# EAGLE design ERpcuk (EAGLE 7.7.0)

## Sheet 1 of 2
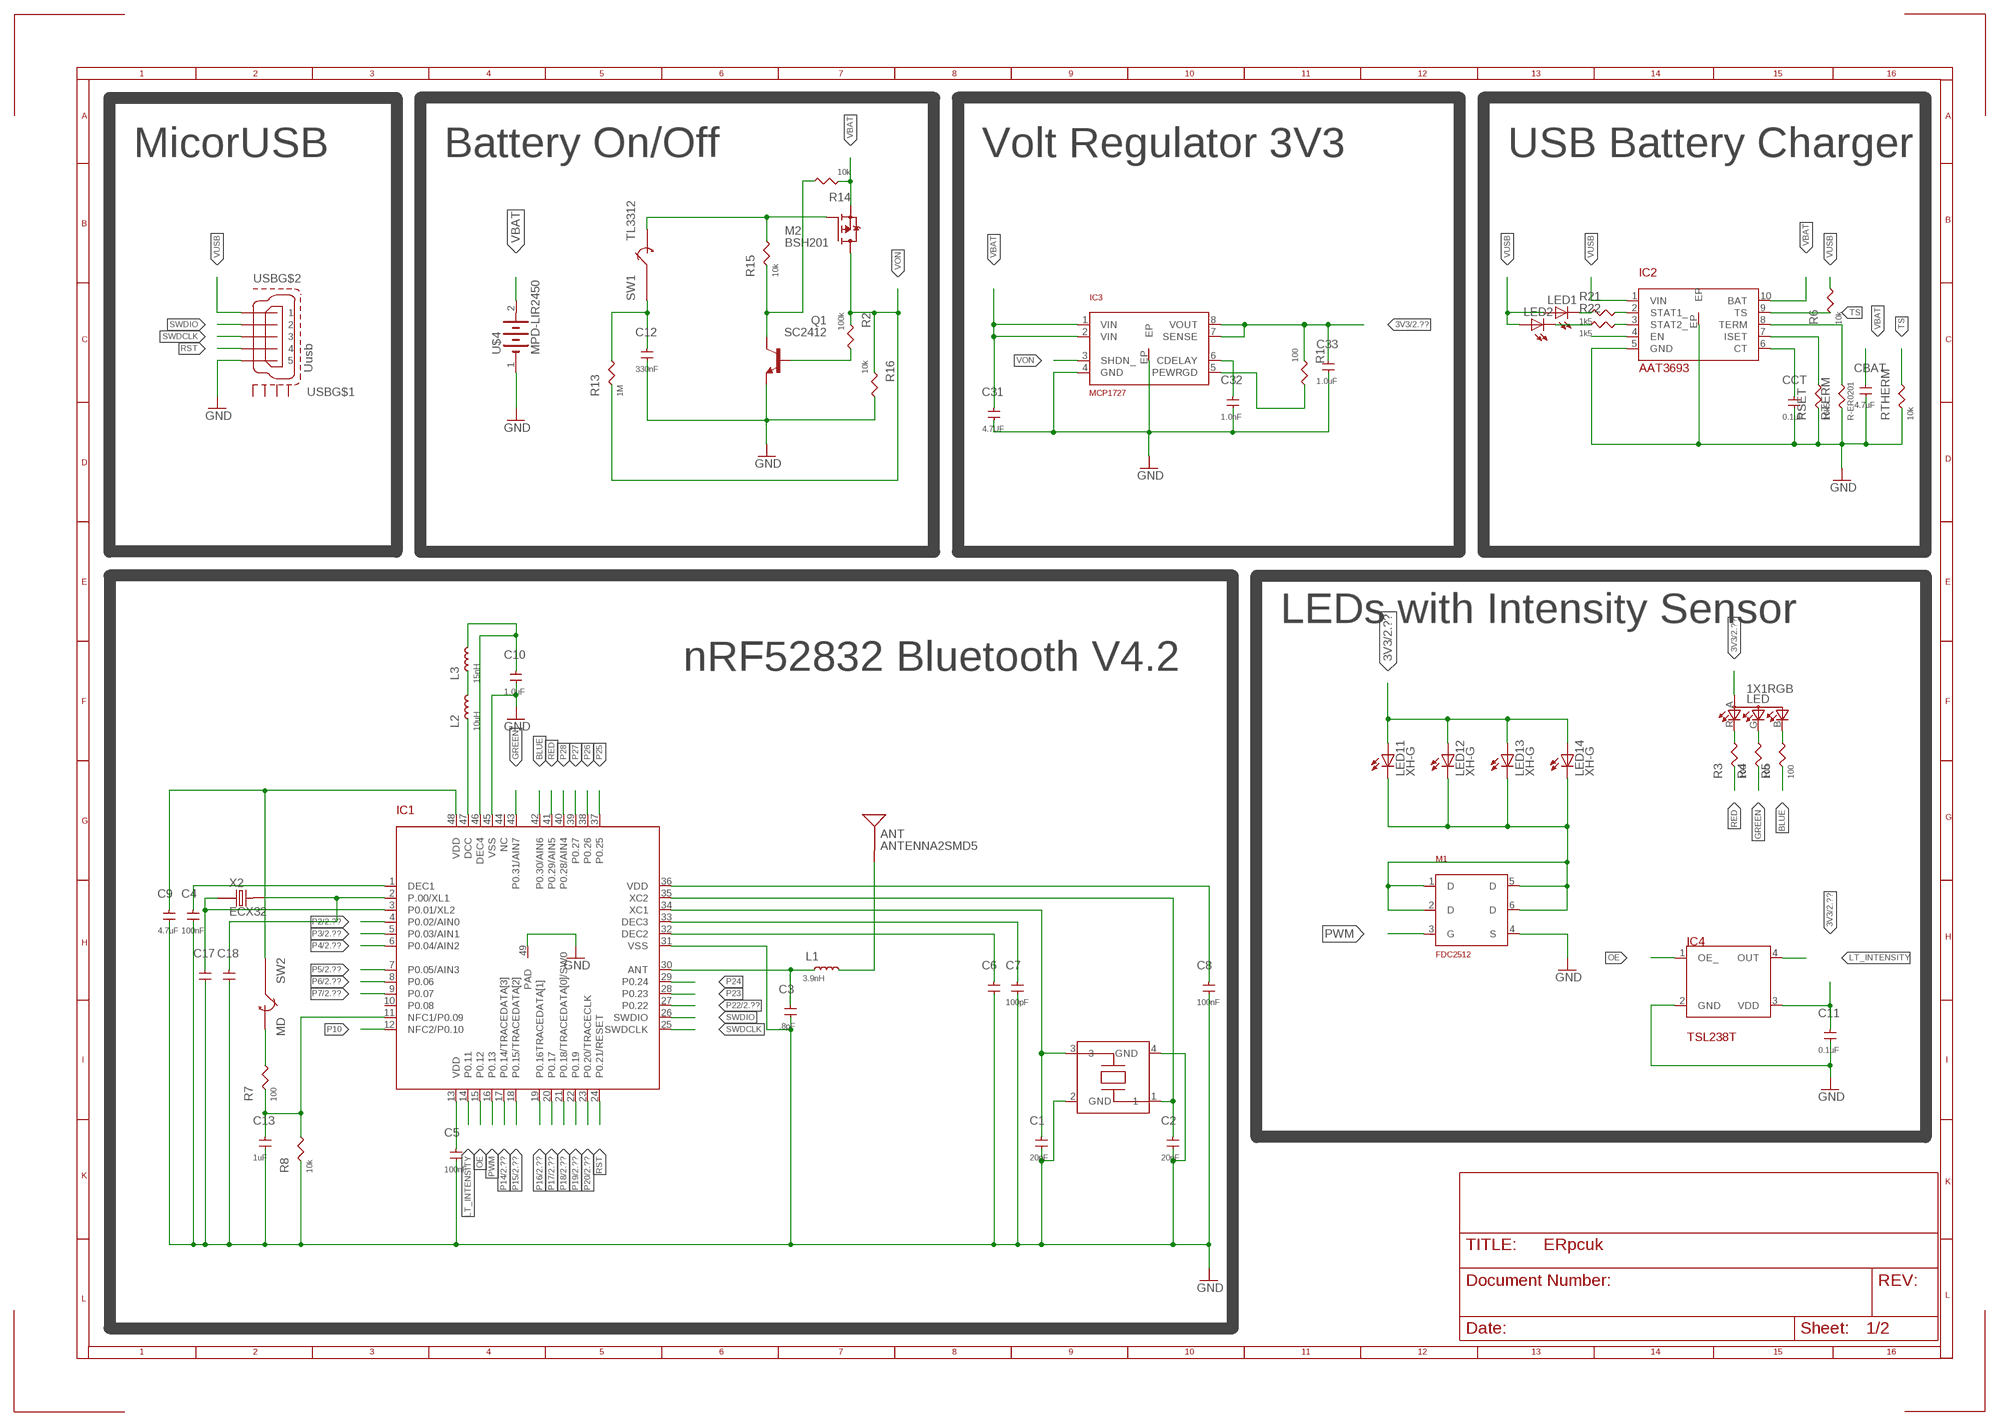
[diagram p0: schematic, sheet 1]

### Parts
ANT  ANTENNA2SMD5  [ANTENNA-CHIP5]
C1  20pF  C-ER201  [C0201]
C2  20pF  C-ER201  [C0201]
C3  .8pF  C-ER201  [C0201]
C4  100nF  C-ER201  [C0201]
C5  100nF  C-ER201  [C0201]
C6  C-ER201  [C0201]
C7  100pF  C-ER201  [C0201]
C8  100nF  C-ER201  [C0201]
C9  4.7uF  C-ERC0402  [C0402]
C10  1.0uF  C-ER201  [C0201]
C11  0.1uF  C-ER201  [C0201]
C12  330nF  C-ER201  [C0201]
C13  1uF  C-ER201  [C0201]
C17  C-ER201  [C0201]
C18  C-ER201  [C0201]
C31  4.7UF  C-ERC0402  [C0402]
C32  1.0nF  C-ER201  [C0201]
C33  1.0uF  C-ER201  [C0201]
CBAT  4.7uF  C-ERC0402  [C0402]
CCT  0.1uF  C-ER201  [C0201]
IC1  NRF52832  [QFN48]
IC2  AAT3693  [AAT3693]
IC3  MCP1727  [DFN8-3X3]
IC4  TSL238T  [T4]
L1  3.9nH  L-ER0201  [C0201]
L2  10uH  L-ERL603  [R0603]
L3  15nH  L-ER0201  [C0201]
LED  1X1RGB  [1X1]
LED1  LEDCHIP-LED0603  [CHIP-LED0603]
LED2  LEDCHIP-LED0603  [CHIP-LED0603]
LED11  XH-G  [XH-G]
LED12  XH-G  [XH-G]
LED13  XH-G  [XH-G]
LED14  XH-G  [XH-G]
M1  FDC2512  [SSOT6]
M2  BSH201  [SOT23]
Q1  SC2412  [SC59-BEC]
R1  100  R-ER0201  [R0201]
R2  100k  R-ER0201  [R0201]
R3  100  R-ER0201  [R0201]
R4  100  R-ER0201  [R0201]
R5  100  R-ER0201  [R0201]
R6  10k  R-ER0201  [R0201]
R7  100  R-ER0201  [R0201]
R8  10k  R-ER0201  [R0201]
R13  1M  R-ER0201  [R0201]
R14  10k  R-ER0201  [R0201]
R15  10k  R-ER0201  [R0201]
R16  10k  R-ER0201  [R0201]
R21  1k5  R-ER0201  [R0201]
R22  1k5  R-ER0201  [R0201]
RSET  16k5  R-ER0201  [R0201]
RTERM  R-ER0201  [R0201]
RTHERM  10k  R-ER0201  [R0201]
SW1  TL3312  [TL3312]
SW2  MD  [MD]
U$4  MPD-LIR2450  [LIR2450]
USB  Uusb  MICRO-USB-SHIELD-ZX62R-B-5P  [ZX62R-B-5P]
X1  FA-128  [FA-128]
X2  ECX32  [ECX39]

### Nets
3V3: C5.2 C8.2 C9.2 C11.2 C33.2 IC1.13(VDD) IC1.36(VDD) IC1.48(VDD) IC3.7(SENSE) IC3.8(VOUT) IC4.3(VDD) LED11.2(A) LED12.2(A) LED13.2(A) LED14.2(A) LED.A(A2) R1.1 SW2.P$1 ; also sheet 2
BLUE: IC1.42(P0.30/AIN6) R5.1
GND: C1.1 C2.1 C3.1 C4.1 C5.1 C6.1 C7.1 C8.1 C9.1 C10.1 C11.1 C12.1 C13.1 C17.1 C18.1 C31.1 C32.1 C33.1 CBAT.1 CCT.1 IC1.31(VSS) IC1.45(VSS) IC1.49(PAD) IC2.5(GND) IC2.EP IC3.4(GND) IC3.EP IC4.2(GND) M1.4(S) Q1.E R8.1 R16.2 RSET.1 RTERM.1 RTHERM.1 U$4.1(-) USB.1 X1.2(GND) X1.4(GND) ; also sheet 2
GREEN: IC1.43(P0.31/AIN7) R4.1
LT_INTENSITY: IC1.14(P0.11) IC4.4(OUT)
N$2: LED11.1(C) LED12.1(C) LED13.1(C) LED14.1(C) M1.1(D) M1.2(D) M1.5(D) M1.6(D)
N$3: Q1.B R2.2
N$4: C3.2 IC1.30(ANT) L1.1
N$5: C6.2 IC1.32(DEC2)
N$6: ANT.FEED(SIGNAL) L1.2
N$7: C7.2 IC1.33(DEC3)
N$8: C1.2 IC1.34(XC1) X1.3
N$9: C2.2 IC1.35(XC2) X1.1
N$10: Q1.C R14.2 R15.1
N$11: IC1.47(DCC) L2.1
N$12: L2.2 L3.1
N$13: C10.2 IC1.46(DEC4) L3.2
N$15: C12.2 R13.2 SW1.1
N$16: LED.B(CGREEN) R5.2
N$17: CCT.2 IC2.6(CT)
N$18: IC2.7(ISET) RSET.2
N$19: IC2.8(TERM) RTERM.2
N$20: IC2.3(STAT2_) R22.2
N$21: IC2.2(STAT1_) R21.2
N$22: LED1.C R21.1
N$23: LED2.C R22.1
N$24: LED.G(CBLUE) R4.2
N$25: IC3.5(PEWRGD) R1.2
N$26: LED.R(CRED) R3.2
N$27: C32.2 IC3.6(CDELAY)
N$28: M2.1(G) R15.2 SW1.3
N$31: C18.2 IC1.2(P.00/XL1) X2.P$2
N$32: C17.2 IC1.3(P0.01/XL2) X2.P$1
N$34: R7.2 SW2.P$2
N$35: C13.2 IC1.11(NFC1/P0.09) R7.1 R8.2
N$36: C4.2 IC1.1(DEC1)
OE: IC1.15(P0.12) IC4.1(OE_)
P2: IC1.4(P0.02/AIN0) ; also sheet 2
P3: IC1.5(P0.03/AIN1) ; also sheet 2
P4: IC1.6(P0.04/AIN2) ; also sheet 2
P5: IC1.7(P0.05/AIN3) ; also sheet 2
P6: IC1.8(P0.06) ; also sheet 2
P7: IC1.9(P0.07) ; also sheet 2
P10: IC1.12(NFC2/P0.10)
P14: IC1.17(P0.14/TRACEDATA[3]) ; also sheet 2
P15: IC1.18(P0.15/TRACEDATA[2]) ; also sheet 2
P16: IC1.19(P0.16TRACEDATA[1]) ; also sheet 2
P17: IC1.20(P0.17) ; also sheet 2
P18: IC1.21(P0.18/TRACEDATA[0]/SW0) ; also sheet 2
P19: IC1.22(P0.19) ; also sheet 2
P20: IC1.23(P0.20/TRACECLK) ; also sheet 2
P22: IC1.27(P0.22) ; also sheet 2
P23: IC1.28(P0.23)
P24: IC1.29(P0.24)
P25: IC1.37(P0.25)
P26: IC1.38(P0.26)
P27: IC1.39(P0.27)
P28: IC1.40(P0.28/AIN4)
PWM: IC1.16(P0.13) M1.3(G)
RED: IC1.41(P0.29/AIN5) R3.1
RST: IC1.24(P0.21/RESET) USB.2
SWDCLK: IC1.25(SWDCLK) USB.3
SWDIO: IC1.26(SWDIO) USB.4
TS: IC2.9(TS) R6.1 RTHERM.2
VBAT: C31.2 CBAT.2 IC2.10(BAT) IC3.1(VIN) IC3.2(VIN) M2.2(S) R14.1 U$4.2(+)
VON: IC3.3(SHDN_) M2.3(D) R2.1 R13.1 R16.1
VUSB: IC2.1(VIN) IC2.4(EN) LED1.A LED2.A R6.2 USB.5
Unconnected: IC1.10(P0.08) IC1.44(NC) USB.M1(S1) USB.M2(S2) USB.M3(S3) USB.M4(S4)

### Notes on the sheet
- MicorUSB | Battery On/Off | Volt Regulator 3V3 | USB Battery Charger
- LEDs with Intensity Sensor
- nRF52832 Bluetooth V4.2

## Sheet 2 of 2
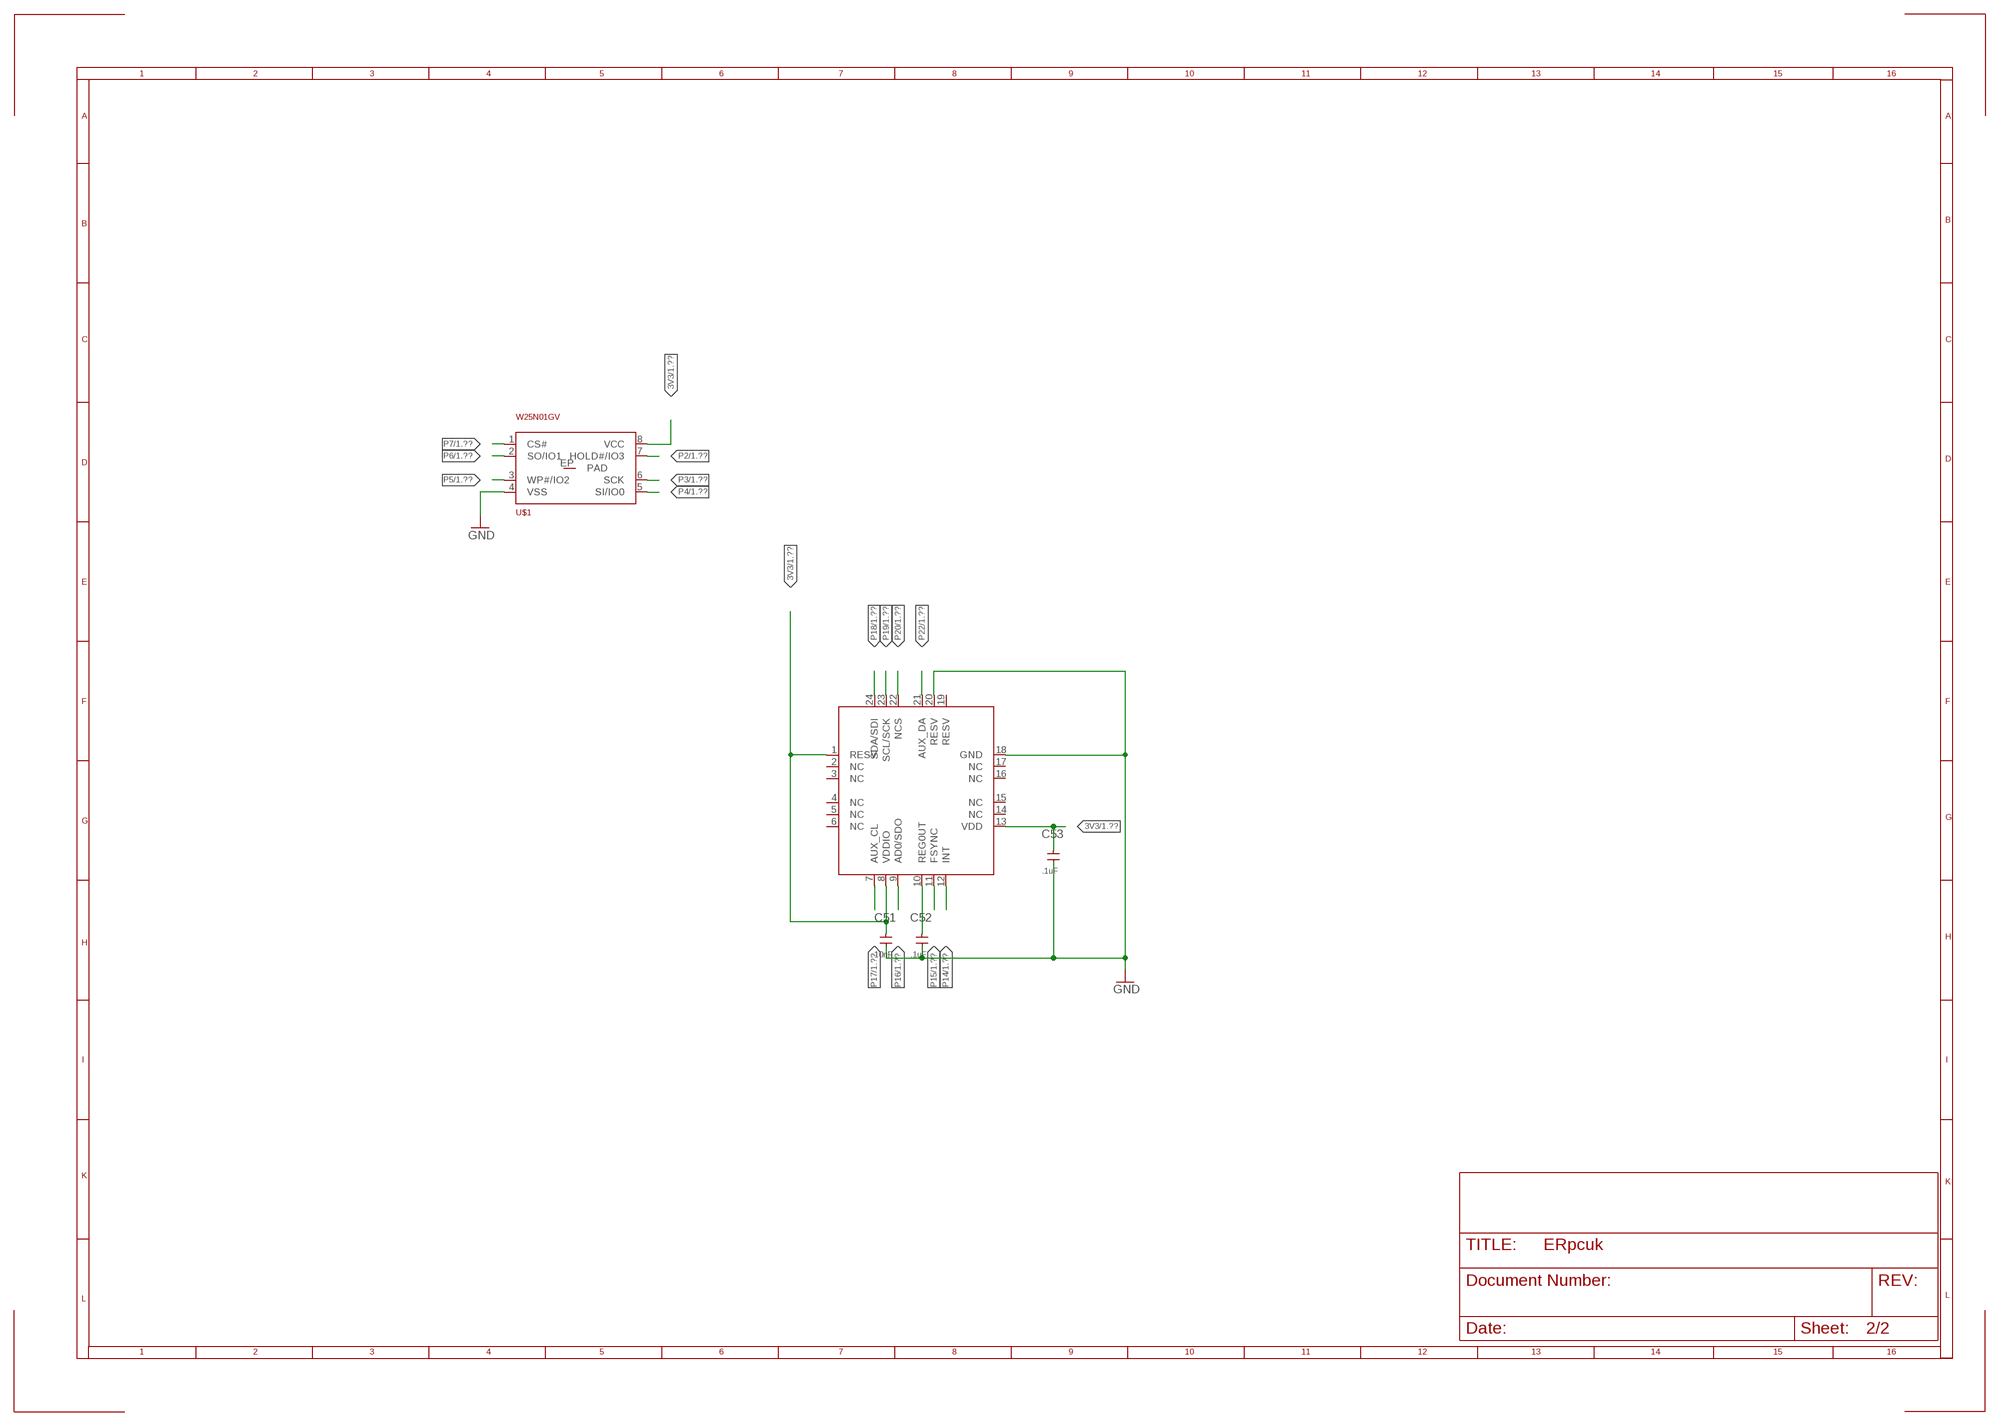
[diagram p1: schematic, sheet 2]

### Parts
C51  10nF  C-ER201  [C0201]
C52  .1uF  C-ER201  [C0201]
C53  .1uF  C-ER201  [C0201]
IC5  MPU9250  MPU9250_CORRECTED  [3X3_24_QFN_CORRECTED]
U$1  W25N01GV  [8WSON6X8]

### Nets
3V3: C51.2 C53.2 IC5.1(RESV) IC5.8(VDDIO) IC5.13(VDD) U$1.8(VCC) ; also sheet 1
GND: C51.1 C52.1 C53.1 IC5.18(GND) IC5.20(RESV) U$1.4(VSS) ; also sheet 1
N$33: C52.2 IC5.10(REG0UT)
P2: U$1.7(HOLD#/IO3) ; also sheet 1
P3: U$1.6(SCK) ; also sheet 1
P4: U$1.5(SI/IO0) ; also sheet 1
P5: U$1.3(WP#/IO2) ; also sheet 1
P6: U$1.2(SO/IO1) ; also sheet 1
P7: U$1.1(CS#) ; also sheet 1
P14: IC5.12(INT) ; also sheet 1
P15: IC5.11(FSYNC) ; also sheet 1
P16: IC5.9(AD0/SDO) ; also sheet 1
P17: IC5.7(AUX_CL) ; also sheet 1
P18: IC5.24(SDA/SDI) ; also sheet 1
P19: IC5.23(SCL/SCK) ; also sheet 1
P20: IC5.22(NCS) ; also sheet 1
P22: IC5.21(AUX_DA) ; also sheet 1
Unconnected: IC5.2(NC) IC5.3(NC) IC5.4(NC) IC5.5(NC) IC5.6(NC) IC5.14(NC) IC5.15(NC) IC5.16(NC) IC5.17(NC) IC5.19(RESV) U$1.EP(PAD)

## Library data of the parts
ANT = SparkFun:ANTENNA2: Antenna Single endded antenna. Common with smaller chip antennas. CHIP4 package is the GPS Chip Antenna SKU: GPS-08418. CHIP5 package is 2.4GHz chip antenna SKU: WRL-00144.
C1-C13 C17 C18 C31-C33 C51-C53 CBAT CCT = rcl:C-ER
IC1 = Nordic:NRF52832
IC2 = skyworks:AAT3693
IC3 = microchip:MCP1727
IC4 = AMS:TSL238T
IC5 = invensense:MPU9250_CORRECTED
L1-L3 = rcl:L-ER
LED = led:1X1RGB
LED1 LED2 = led:LED: LED OSRAM: - CHIPLED LG R971, LG N971, LY N971, LG Q971, LY Q971, LO R971, LY R971 LH N974, LH R974 LS Q976, LO Q976, LY Q976 LO Q996 - Hyper CHIPLED LW Q18S LB Q993, LB Q99A, LB R99A - SideLED LS A670, LO A670, LY A670, LG A670, LP A670 LB A673, LV A673, LT A673, LW A673 LH A674 LY A675 LS A676, LA A676, LO A676, LY A676, LW A676 LS A679, LY A679, LG A679 - Hyper Micro SIDELED® LS Y876, LA Y876, LO Y876, LY Y876 LT Y87S - SmartLED LW L88C, LW L88S LB L89C, LB L89S, LG L890 LS L89K, LO L89K, LY L89K LS L896, LA L896, LO L896, LY L896 - TOPLED LS T670, LO T670, LY T670, LG T670, LP T670 LSG T670, LSP T670, LSY T670, LOP T670, LYG T670 LG T671, LOG T671, LSG T671 LB T673, LV T673, LT T673, LW T673 LH T674 LS T676, LA T676, LO T676, LY T676, LB T676, LH T676, LSB T676, LW T676 LB T67C, LV T67C, LT T67C, LS T67K, LO T67K, LY T67K, LW E67C LS E67B, LA E67B, LO E67B, LY E67B, LB E67C, LV E67C, LT E67C LW T67C LS T679, LY T679, LG T679 LS T770, LO T770, LY T770, LG T770, LP T770 LB T773, LV T773, LT T773, LW T773 LH T774 LS E675, LA E675, LY E675, LS T675 LS T776, LA T776, LO T776, LY T776, LB T776 LHGB T686 LT T68C, LB T68C - Hyper Mini TOPLED® LB M676 - Mini TOPLED Santana® LG M470 LS M47K, LO M47K, LY M47K Source: http://www.osram.convergy.de LUXEON: - LUMILED® LXK2-PW12-R00, LXK2-PW12-S00, LXK2-PW14-U00, LXK2-PW14-V00 LXK2-PM12-R00, LXK2-PM12-S00, LXK2-PM14-U00 LXK2-PE12-Q00, LXK2-PE12-R00, LXK2-PE12-S00, LXK2-PE14-T00, LXK2-PE14-U00 LXK2-PB12-K00, LXK2-PB12-L00, LXK2-PB12-M00, LXK2-PB14-N00, LXK2-PB14-P00, LXK2-PB14-Q00 LXK2-PR12-L00, LXK2-PR12-M00, LXK2-PR14-Q00, LXK2-PR14-R00 LXK2-PD12-Q00, LXK2-PD12-R00, LXK2-PD12-S00 LXK2-PH12-R00, LXK2-PH12-S00 LXK2-PL12-P00, LXK2-PL12-Q00, LXK2-PL12-R00 Source: www.luxeon.com KINGBRIGHT: KA-3528ASYC Source: www.kingbright.com
LED11-LED14 = led:XH-G
M1 = transistor-fet:FDC2512
M2 = transistor-fet:BSH201
Q1 = transistor-npn:SC2412
R1-R8 R13-R16 R21 R22 RSET RTERM RTHERM = rcl:R-ER
SW1 = switch-omron:TL3312; DIGIKEY: EG4620CT-ND
SW2 = switch-omron:MD; DIGIKEY: 401-1932-ND
U$1 = st-microelectronics:W25N01GV
U$4 = battery:MPD-LIR2450
USB = con-hirose:MICRO-USB-SHIELD-: Hirose Micro USB Connector ZX62R-B-5P: Micro B, reverse (top mount) shell SMT Supplier: DigiKey H11574CT-ND Source: http://www.hirose.co.jp/cataloge_hp/e24200011.pdf
X1 = crystal:FA-128
X2 = crystal:ECX32

## Board
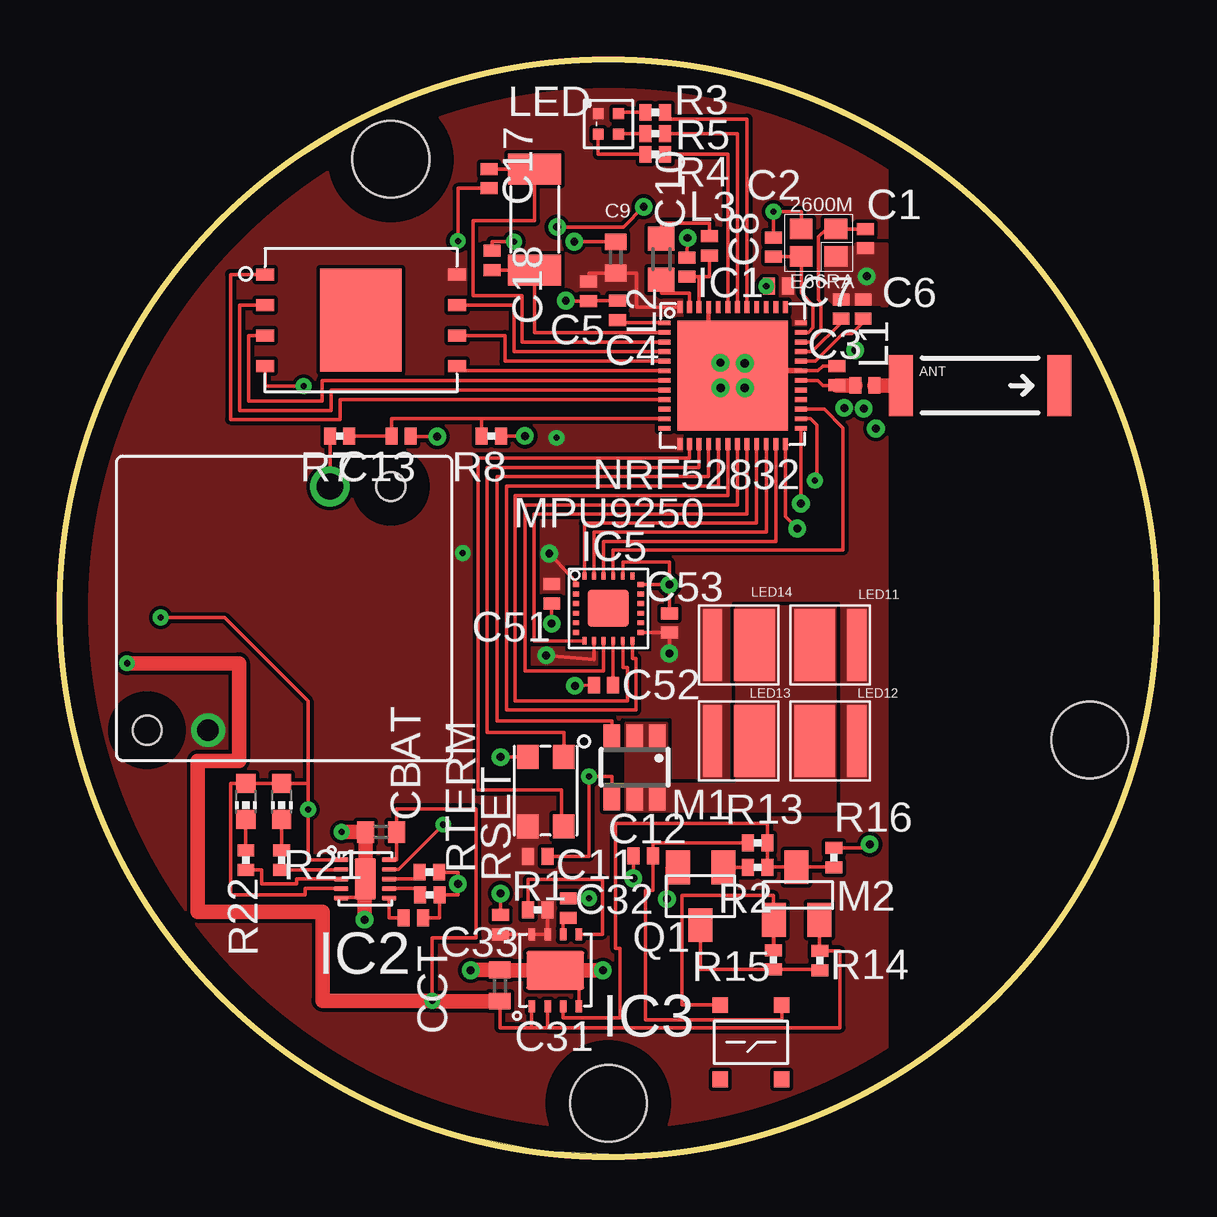
[diagram p2: board, top side]
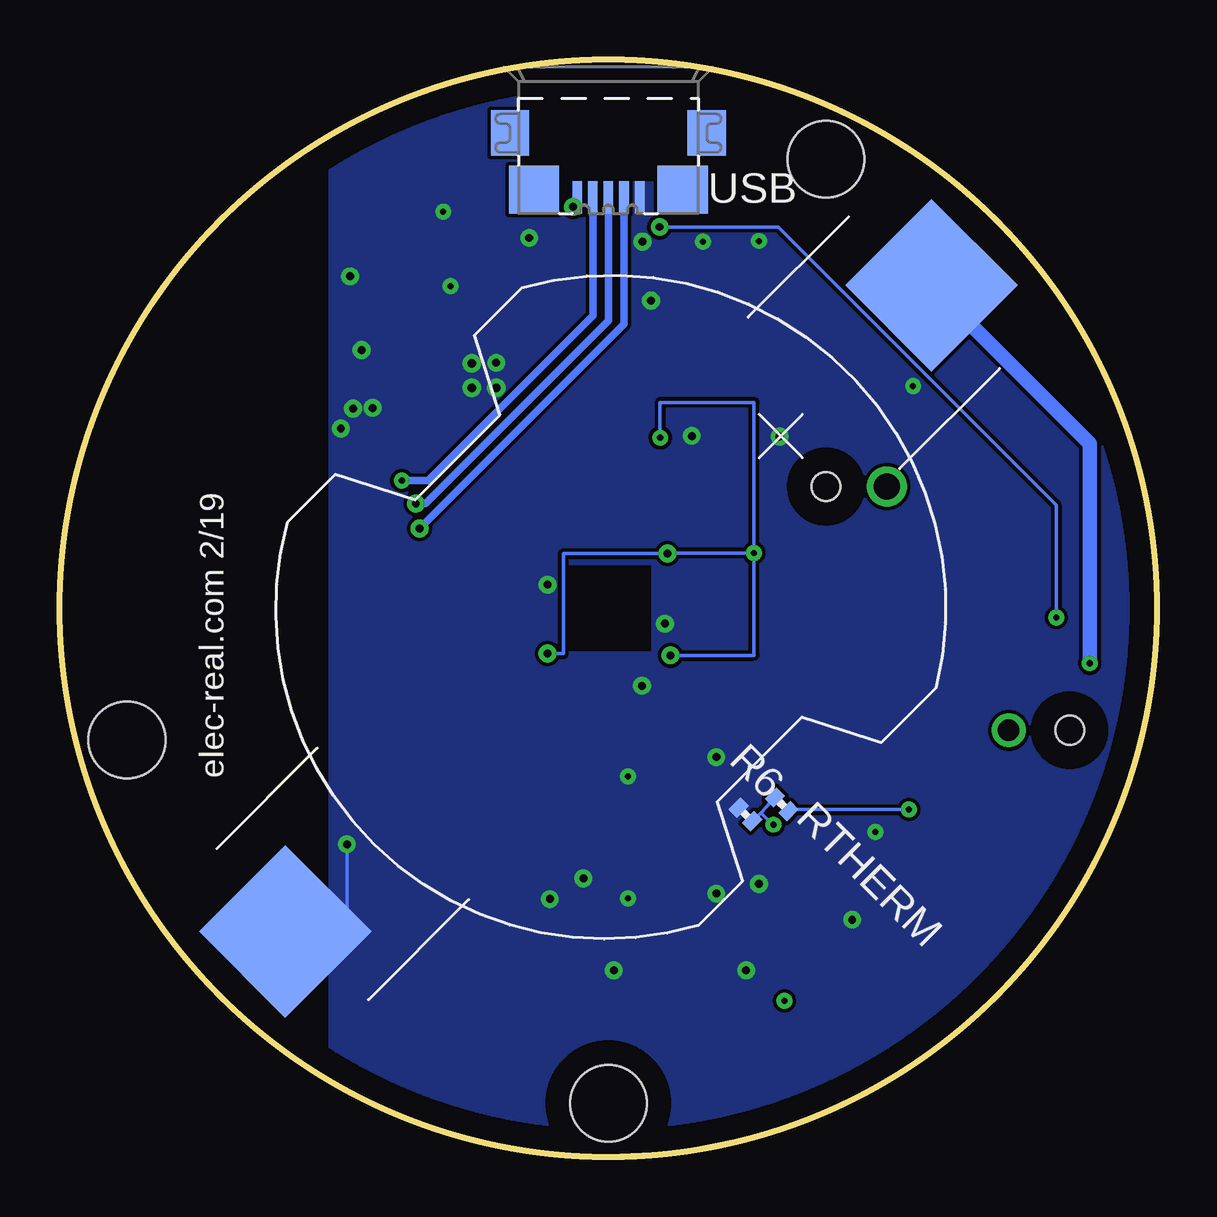
[diagram p3: board, bottom side, seen from below]

Size 45.72 x 45.72 mm. Coordinates in mm from the lower left corner, seen from the top.
Outline: circle at 22.86,22.86 radius 22.86
Copper layers (1*16): Top 0.035mm / dielectric 1.5mm / Bottom 0.035mm
Design rules "default *": minimum track width 6mil, minimum drill 10mil, track to track 6mil, track to pad 6mil, pad to pad 6mil, via to via 6mil, smd to smd 6mil, copper to edge 40mil, drill to drill 8mil, minimum pad ring 10mil, minimum via ring 8mil, stop-mask expansion 2mil, vias tented up to drill 0mil, thermal gap 10mil
Holes 3.2 mm at 13.79,41.58 42.93,17.37 22.86,2.24
Milling: 48 lines

### Footprints (pad centres in the part's own frame; a part is rotated, then mirrored left to right if it is on the bottom)
ANTENNA-CHIP5 = smd 1.016 x 2.54: FEED -3.302,0; NC 3.302,0
C0201 = smd 0.5 x 0.7: 1 -0.4,0; 2 0.4,0
C0402 = smd 0.7 x 0.9: 1 -0.65,0; 2 0.65,0
QFN48 = smd 0.5 x 0.2: 1 -2.85,2.2; 2 -2.85,1.8; 3 -2.85,1.4; 4 -2.85,1; 5 -2.85,0.6; 6 -2.85,0.2; 7 -2.85,-0.2; 8 -2.85,-0.6; 9 -2.85,-1; 10 -2.85,-1.4; 11 -2.85,-1.8; 12 -2.85,-2.2; 25 2.85,-2.2; 26 2.85,-1.8; 27 2.85,-1.4; 28 2.85,-1; 29 2.85,-0.6; 30 2.85,-0.2; 31 2.85,0.2; 32 2.85,0.6; 33 2.85,1; 34 2.85,1.4; 35 2.85,1.8; 36 2.85,2.2 | smd 0.2 x 0.5: 13 -2.2,-2.85; 14 -1.8,-2.85; 15 -1.4,-2.85; 16 -1,-2.85; 17 -0.6,-2.85; 18 -0.2,-2.85; 19 0.2,-2.85; 20 0.6,-2.85; 21 1,-2.85; 22 1.4,-2.85; 23 1.8,-2.85; 24 2.2,-2.85; 37 2.2,2.85; 38 1.8,2.85; 39 1.4,2.85; 40 1,2.85; 41 0.6,2.85; 42 0.2,2.85; 43 -0.2,2.85; 44 -0.6,2.85; 45 -1,2.85; 46 -1.4,2.85; 47 -1.8,2.85; 48 -2.2,2.85 | smd 4.6 x 4.6: 49 0,0
AAT3693 = smd 0.6 x 0.2: 1 -1,0.8; 2 -1,0.4; 3 -1,0; 4 -1,-0.4; 5 -1,-0.8; 6 1,-0.8; 7 1,-0.4; 8 1,0; 9 1,0.4; 10 1,0.8 | smd 0.9 x 1.7: EP 0,0
DFN8-3X3 = smd 0.5 x 0.3: 1 -1.5,0.975; 2 -1.5,0.325; 3 -1.5,-0.325; 4 -1.5,-0.975; 5 1.5,-0.975; 6 1.5,-0.325; 7 1.5,0.325; 8 1.5,0.975 | smd 1.6 x 2.4: EP 0,0
T4 = smd 1 x 0.9: 1 -1.45,0.75; 2 -1.45,-0.75; 3 1.45,-0.75; 4 1.45,0.75
3X3_24_QFN_CORRECTED = smd 0.3 x 0.2: 1 -1.35,1; 2 -1.35,0.6; 3 -1.35,0.2; 4 -1.35,-0.2; 5 -1.35,-0.6; 6 -1.35,-1; 13 1.35,-1; 14 1.35,-0.6; 15 1.35,-0.2; 16 1.35,0.2; 17 1.35,0.6; 18 1.35,1 | smd 0.2 x 0.3: 7 -1,-1.35; 8 -0.6,-1.35; 9 -0.2,-1.35; 10 0.2,-1.35; 11 0.6,-1.35; 12 1,-1.35; 19 1,1.35; 20 0.6,1.35; 21 0.2,1.35; 22 -0.2,1.35; 23 -0.6,1.35; 24 -1,1.35 | smd 1.7 x 1.54: P$2 0,0
R0603 = smd 1 x 1.1: 1 -0.85,0; 2 0.85,0
1X1 = smd 0.45 x 0.45: A 0.425,0.425; B -0.425,-0.425; G -0.425,0.425; R 0.425,-0.425
CHIP-LED0603 = smd 0.8 x 0.8: A 0,-0.75; C 0,0.75
XH-G = smd 1.7 x 3: 1 -0.65,0 | smd 0.8 x 3: 2 1.1,0
SSOT6 = smd 0.69 x 0.99: 1 -0.95,-1.3; 2 0,-1.3; 3 0.95,-1.3; 4 0.95,1.3; 5 0,1.3; 6 -0.95,1.3
SOT23 = smd 1 x 1.4: 1 -0.95,-1.1; 2 0.95,-1.1; 3 0,1.1
SC59-BEC = smd 1 x 1.4: B -0.95,-1.2; C 0,1.2; E 0.95,-1.2
R0201 = smd 0.5 x 0.7: 1 -0.4,0; 2 0.4,0
TL3312 = smd 0.66 x 0.635: 1 -1.549,1.28; 2 1.549,1.28; 3 -1.549,-1.28; 4 1.549,-1.28
MD = drill 0.9: P$1 5.08,-2.54 | drill 1.1: P$2 -5.08,2.54 | hole 1.2: 5.08,-5.08; -5.08,5.08
8WSON6X8 = smd 0.75 x 0.5: 1 -4,1.905; 2 -4,0.635; 3 -4,-0.635; 4 -4,-1.905; 5 4,-1.905; 6 4,-0.635; 7 4,0.635; 8 4,1.905 | smd 3.404 x 4.293: EP 0,0
LIR2450 = smd 5.08 x 5.08: 1 -19.05,0; 2 19.05,0
ZX62R-B-5P = smd 1.35 x 0.4: 1 2.675,1.3; 2 2.675,0.65; 3 2.675,0; 4 2.675,-0.65; 5 2.675,-1.3 | smd 1.9 x 1.6: M1 0,-4.1; M2 0,4.1 | smd 2 x 2.1: M3 2.35,3.1; M4 2.35,-3.1
FA-128 = smd 0.95 x 0.85: 1 -0.725,-0.575; 2 0.725,-0.575; 3 0.725,0.575; 4 -0.725,0.575
ECX39 = smd 1.3 x 2.2: P$1 -2.1,0; P$2 2.1,0

### Placement (x,y rotation side)
ANT  38.35,32.16 0 top
C1  33.58,38.28 90 top
C2  29.74,37.92 270 top
C3  32.38,32.56 270 top
C4  23.24,35.28 270 top
C5  22.03,36.07 90 top
C6  33.48,35.33 270 top
C7  32.56,35.33 270 top
C8  29.95,36.3 0 top
C9  23.16,37.49 270 top
C10  26.14,37.08 270 top
C11  19.91,12.52 180 top
C12  24.31,12.54 0 top
C13  14.22,30.05 180 top
C17  17.88,40.77 90 top
C18  18.01,37.36 270 top
C31  18.34,7.14 270 top
C32  21.18,10.36 270 top
C33  18.36,9.68 270 top
C51  20.5,23.47 90 top
C52  22.66,19.66 0 top
C53  25.4,22.25 270 top
CBAT  13.39,13.54 0 top
CCT  14.73,9.96 180 top
IC1  28.04,32.56 0 top
IC2  12.73,11.58 0 top
IC3  20.65,7.77 90 top
IC4  20.24,15.21 270 top
IC5  22.86,22.86 0 top
L1  33.55,32.16 0 top
L2  25.07,37.41 90 top
L3  27.08,37.97 270 top
LED  22.86,43.05 90 top
LED1  9.25,14.81 180 top
LED2  7.75,14.81 180 top
LED11  32.11,21.33 0 top
LED12  32.11,17.33 0 top
LED13  28.3,17.33 180 top
LED14  28.3,21.33 180 top
M1  23.95,16.23 180 top
M2  30.7,10.98 0 top
Q1  26.7,10.87 180 top
R1  19.91,10.29 180 top
R2  29.08,12.06 180 top
R3  24.82,43.54 180 top
R4  24.82,41.78 180 top
R5  24.82,42.65 180 top
R6  15.64,14.7 315 bottom
R7  11.66,30.05 180 top
R8  17.98,30.05 180 top
R13  29.08,13.08 180 top
R14  31.67,8.18 270 top
R15  29.74,8.2 90 top
R16  32.26,12.47 90 top
R21  9.25,12.37 270 top
R22  7.75,12.37 270 top
RSET  15.42,10.92 180 top
RTERM  15.39,11.86 180 top
RTHERM  17.15,14.27 315 bottom
SW1  28.8,4.78 270 top
SW2  8.71,22.86 270 top
U$1  12.55,34.87 0 top
U$4  22.86,22.86 45 bottom
USB  22.86,42.67 270 bottom
X1  31.62,38.1 0 top
X2  19.79,39.07 270 top

### Tracks (layer width: path | path; a pad name or v marks a point on that pad's centre or on a via)
3V3  (via drill 0.25, 0.33)
  Top 0.152: R1.1 20.32,10.29 IC3.7 IC3.8 C33.2 | IC1.48 24.03,35.41 24.03,36.83 C9.2 22.05,36.84 C5.2 | IC5.1 21.51,23.96 v20.4,25.15 | v25.4,20.98 C53.2 IC5.13 | IC5.8 22.26,20.73 v20.27,20.9
  Bottom 0.152: v20.27,20.9 16.79,20.9 v16.79,25.17 | v25.4,20.98 24.74,20.98 24.74,25.15 v20.4,25.15 20.4,25.17 v16.79,25.17 | v20.7,29.97 20.7,31.45 16.79,31.45 v16.79,25.17
  pour Top (rank 2, no thermals): 0,0 45.72,0 45.72,45.72 0,45.72
BLUE
  Top 0.152: IC1.42 28.24,42.65 R5.1
GND  (via drill 0.25, 0.33, 0.34, 0.36)
  Top 0.152: IC1.31 31.59,32.76 31.8,32.97 C3.1 | IC3.4 21.62,7.77 22.1,7.77 | C33.1 v18.36,10.97 | IC2.5 11.72,10.82 12.7,10.82 | RTERM.1 16.59,11.86 v16.59,11.38 16.59,10.92 RSET.1 15.82,9.96 CCT.1 | C12.1 v23.9,11.61 | Q1.E 25.3,12.06 v25.3,10.74 | C52.1 v21.46,19.63 | C51.1 v20.5,22.23 | C53.1 v25.4,23.85 | v25.4,23.85 v25.4,23.86 | v25.4,23.85 25.4,24.79 23.46,24.79 IC5.20 | R16.2 33.6,12.87 v33.76,13.03 | C9.1 23.15,38.15 v21.44,38.15 | C4.1 C5.1 21.18,35.67 v21.08,35.69 | C10.1 v26.16,38.3 | IC5.18 v25.4,23.85 | 28.04,33.07 IC1.49 | IC4.2 v18.36,16.66 | X1.4 30.9,39.4 v29.74,39.4 C2.1 | M1.4 23,15.85 v22.05,15.85 22.05,12.52 C11.1 | C32.1 v22.05,10.77 22.02,10.74 | C8.1 v29.44,36.3 | C18.1 18.01,38.15 v18.92,38.15 | C17.1 16.59,40.37 v16.59,38.18 | U$1.4 8.55,32.13 v10.16,32.13 | C13.1 14.62,30.02 v15.72,30.02 | R8.1 v19.38,30.05
  Top 0.178: 28.55,32.76 v28.55,33.07 28.04,33.07 | IC1.45 27.04,33.59 v27.53,33.1 | 12.7,9.84 IC2.EP
  Top 0.22: IC1.31 28.86,32.76 arc-90 v28.55,33.07
  Top 0.61: 17.14,7.79 C31.1 arc90 18.35,7.77 IC3.EP 22.1,7.77 v22.63,7.77 | 12.7,9.84 12.7,10.82 | v11.73,13.54 CBAT.1 IC2.EP
  Bottom 0.152: U$4.1 36.33,10.11 33.76,10.11 v33.76,13.03
  other vias: 27.53,32.05 28.55,32.05 17.12,7.77 12.7,9.88 33.15,33.63 33.5,31.19 34.01,30.35 32.69,31.22 33.63,36.7
  pour Bottom (no thermals): 0,0 45.72,0 45.72,45.72 0,45.72
  pour Top (no thermals): 34.26,35.48 34.47,35.48 34.47,38.05 33.17,38.05 33.17,37.97 33.17,37.9 31.93,37.9 31.93,35.86 32.26,35.53 34.21,35.53
GREEN
  Top 0.152: IC1.43 27.84,41.78 R4.1
LT_INTENSITY
  Top 0.152: IC1.14 26.24,29.13 17.42,29.13 17.42,15.29 20.9,15.29 20.9,13.77 IC4.4
N$1
  cutout Top: 47.5,41.15 47.5,4.57 34.54,4.57 34.54,41.15
N$2
  pour Top (no thermals): 23.6,18.03 23.6,14.43 31.6,14.43 32.31,14.43 32.31,22.91 28.22,22.91 28.22,15.52 25.27,15.52 25.27,17.98 25.27,18.06 23.6,18.06
N$3
  Top 0.152: Q1.B | Q1.B R2.2
N$4
  Top 0.152: IC1.30 31.59,32.36 31.8,32.16 C3.2
  Top 0.61: C3.2 L1.1
N$5
  Top 0.152: IC1.32 31.49,33.16 32.64,34.31 33.02,34.31 33.48,34.77 C6.2
N$6
  Top 0.61: L1.2 ANT.FEED
N$7
  Top 0.152: IC1.33 31.35,33.56 32.56,34.77 C7.2
N$8
  Top 0.152: IC1.34 31.27,33.96 31.73,34.42 31.73,35.64 31.62,35.74 31.62,38.35 31.94,38.67 X1.3 C1.2
N$9
  Top 0.152: IC1.35 31.19,34.36 31.39,34.57 31.39,35.51 30.91,35.99 30.91,37.51 X1.1 C2.2
N$10
  Top 0.152: R14.2 31.67,7.8 R15.1 26.7,7.8 Q1.C
N$11
  Top 0.152: IC1.47 26.24,35.99 25.07,35.99 L2.1
N$12
  Top 0.152: L3.1 27.08,38.91 25.07,38.91 L2.2
N$13
  Top 0.152: IC1.46 26.64,36.68 | 26.64,36.68 C10.2 | L3.2 27.08,36.68 26.64,36.68
N$14
  cutout Bottom: 47.5,41.15 47.5,4.57 34.54,4.57 34.54,41.15
N$15
  Top 0.152: R13.2 24.71,13.08 C12.2 24.71,11.1 24.41,11.1 24.41,5.71 24.71,5.71 25.07,5.71 30.08,5.71 SW1.1
N$16
  Top 0.152: LED.B 23.29,42.65 R5.2
N$17
  Top 0.152: IC2.6 13.72,9.96 CCT.2
N$18
  Top 0.152: IC2.7 14.99,11.18 RSET.2
N$19
  Top 0.152: IC2.8 14.99,11.58 RTERM.2
N$20
  Top 0.152: IC2.3 9.86,11.58 9.86,11.38 8.41,11.38 8.41,11.96 R22.2
N$21
  Top 0.152: IC2.2 R21.2
N$22
  Top 0.152: R21.1 LED1.C
N$23
  Top 0.152: R22.1 LED2.C
N$24
  Top 0.152: LED.G 22.43,41.78 R4.2
  Top 0.178: LED.G 22.42,42.63
N$25
  Top 0.152: IC3.5 22.61,9.27 22.61,11.56 19.51,11.56 R1.2
N$26
  Top 0.152: LED.R 23.34,43.54 R3.2
N$27
  Top 0.152: IC3.6 20.98,9.96 C32.2
N$28
  Top 0.152: M2.1 29.75,8.6 R15.2 29.74,10.9 25.93,10.9 25.93,6.33 SW1.3
N$29
  cutout Top: 21.08,24.64 24.64,24.64 24.64,21.08 21.08,21.08
N$30
  cutout Bottom: 21.08,24.64 24.64,24.64 24.64,21.08 21.08,21.08
N$31
  Top 0.152: IC1.2 19.79,34.36 X2.P$2 C18.2
N$32
  Top 0.152: IC1.3 19.25,33.96 19.25,35.89 17.22,35.89 17.22,39.01 19.79,39.01 X2.P$1 C17.2
N$33
  Top 0.152: C52.2 23.06,20.47 IC5.10
N$34
  Top 0.152: SW2.P$2 R7.2
N$35
  Top 0.152: R7.1 C13.2 13.82,30.76 17.58,30.76 | IC1.11 17.58,30.76 | 17.58,30.76 R8.2
N$36
  Top 0.152: IC1.1 23.24,34.76 C4.2
OE
  Top 0.152: IC1.15 26.64,28.73 17.8,28.73 17.8,17.68 21.01,17.68 21.01,16.66 IC4.1
P2
  Top 0.152: U$1.7 18.92,35.51 18.92,33.56 IC1.4
P3
  Top 0.152: U$1.6 18.54,34.24 18.54,33.16 IC1.5
P4
  Top 0.152: U$1.5 16.55,32.76 IC1.6
P5
  Top 0.152: U$1.3 7.87,34.24 7.87,31.5 10.92,31.5 10.92,32.36 IC1.7
P6
  Top 0.152: U$1.2 7.49,35.51 7.49,31.11 11.3,31.11 11.3,31.96 IC1.8
P7
  Top 0.152: U$1.1 7.11,36.78 7.11,30.73 11.68,30.73 11.68,31.56 IC1.9
P14
  Top 0.152: IC1.17 27.44,27.96 18.62,27.96 18.62,18.62 24,18.62 24,20.78 23.86,20.78 IC5.12
P15
  Top 0.152: IC1.18 27.84,27.56 18.97,27.56 18.97,19 23.65,19 23.65,20.4 23.46,20.4 IC5.11
P16
  Top 0.152: IC1.19 28.24,27.18 19.38,27.18 19.38,20.24 22.66,20.24 22.66,20.25 IC5.9
P17
  Top 0.152: IC1.20 28.64,26.8 19.76,26.8 19.76,21.51 IC5.7
P18
  Top 0.152: IC1.21 29.04,26.42 21.86,26.42 IC5.24
P19
  Top 0.152: IC1.22 29.44,26.04 22.26,26.04 IC5.23
P20
  Top 0.152: IC1.23 29.84,25.65 22.66,25.65 IC5.22
P22
  Top 0.152: IC1.27 31.86,31.16 32.64,30.38 32.64,25.3 23.06,25.3 IC5.21
PWM
  Top 0.152: IC1.16 27.04,28.35 18.21,28.35 18.21,18.16 23,18.16 M1.3
RED
  Top 0.152: R3.1 25.5,43.26 28.64,43.26 IC1.41
RST  (via drill 0.33)
  Top 0.152: v30.73,26.19 30.24,26.68 IC1.24
  Top 0.178: 30.25,29.7 IC1.24
  Bottom 0.305: USB.2 22.21,34.71 v30.73,26.19
SWDCLK  (via drill 0.33)
  Top 0.152: v30.89,27.23 IC1.25
  Bottom 0.305: USB.3 22.86,34.85 30.48,27.23 v30.89,27.23
SWDIO  (via drill 0.25)
  Top 0.152: IC1.26 31.29,30.76 31.55,30.5 31.55,28.3 v31.47,28.19
  Bottom 0.305: USB.4 23.51,35.06 30.38,28.19 v31.47,28.19
TS  (via drill 0.25)
  Top 0.152: IC2.9 14.12,11.98 v15.98,13.84
  Bottom 0.152: RTHERM.2 16.5,14.35 | 16.5,14.35 R6.1 | v15.98,13.84 16,13.84 16.5,14.35
VBAT  (via drill 0.25)
  Top 0.152: IC3.2 20.32,5.38 | 20.32,5.38 19.66,5.38 | 19.66,5.38 18.34,5.38 C31.2 | IC3.1 19.66,6.27 19.66,5.38 | IC2.10 14.04,12.38 CBAT.2 14.04,14.5 17.35,14.5 17.35,9.12 15.52,9.12 v15.52,6.5 | M2.2 31.66,8.6 R14.1 32.51,8.58 32.51,5.38 20.32,5.38
  Top 0.61: C31.2 15.53,6.49 v15.52,6.5 10.95,6.5 10.95,10.21 5.74,10.21 5.74,16.51 7.47,16.51 7.47,20.57 v2.79,20.57
  Bottom 0.61: U$4.2 2.79,29.73 v2.79,20.57
VON
  Top 0.152: R16.1 M2.3 29.48,12.07 R2.1 R13.1 29.48,13.89 23.16,13.89 23.16,8.69 23.34,8.69 23.34,5.79 20.98,5.79 IC3.3
VUSB  (via drill 0.25, 0.33)
  Top 0.152: v20.73,38.76 23.5,38.76 v24.33,39.6 | IC2.1 10.34,12.38 v10.34,14.48 10.34,15.57 | v4.19,22.48 6.86,22.48 10.34,19 10.34,15.57 | 10.34,15.57 LED1.A LED2.A 7.11,15.56 7.11,10.92 10.21,10.92 10.21,11.18 IC2.4
  Bottom 0.152: v20.73,38.76 15.77,38.76 4.19,27.18 v4.19,22.48 | R6.2 15.29,14.48 v10.34,14.48
  Bottom 0.305: USB.5 24.18,40.36 24.18,39.75 v24.33,39.6

### Text on the board
tPlace: IC2 | IC3
bPlace: elec-real.com 2/19